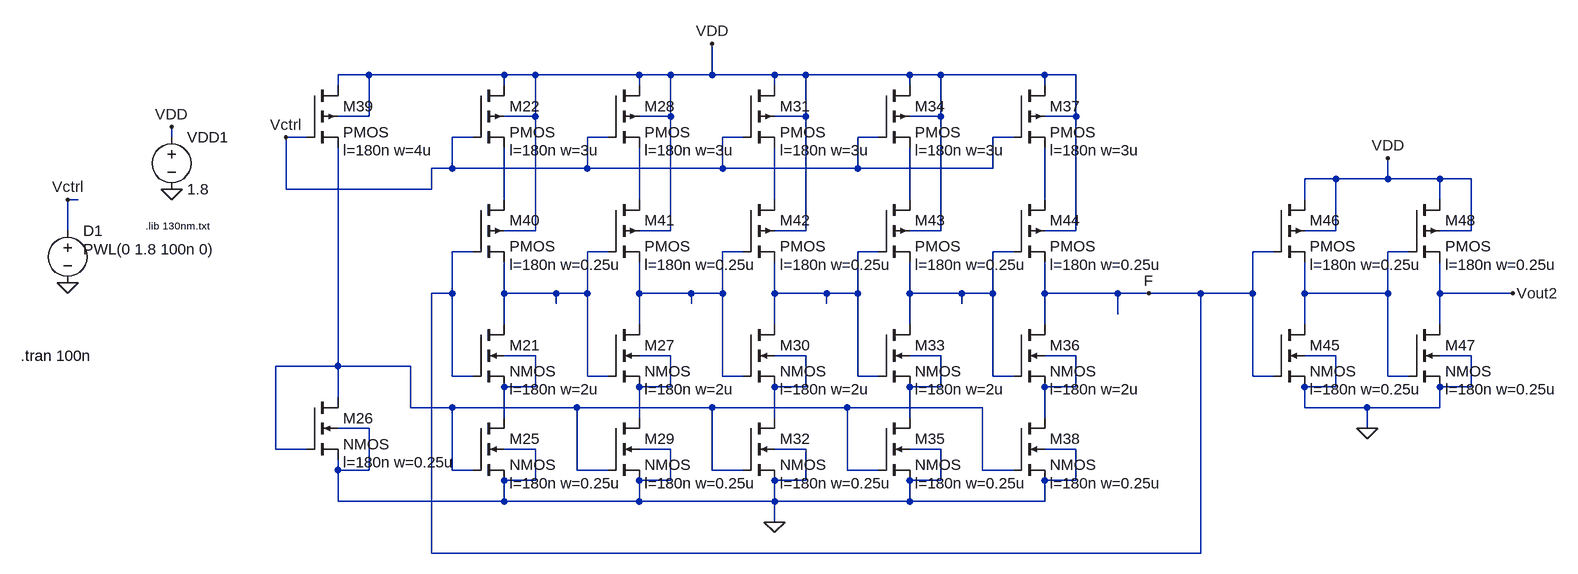
[diagram p0: schematic VCO.asc]
VCO.asc, the LTspice schematic file:
Version 4
SHEET 1 1592 1668
WIRE -544 144 -592 144
WIRE -336 144 -544 144
WIRE -288 144 -336 144
WIRE -128 144 -288 144
WIRE -80 144 -128 144
WIRE -16 144 -16 96
WIRE -16 144 -80 144
WIRE 80 144 -16 144
WIRE 128 144 80 144
WIRE 288 144 128 144
WIRE 336 144 288 144
WIRE 496 144 336 144
WIRE 544 144 496 144
WIRE -592 160 -592 144
WIRE -336 160 -336 144
WIRE -128 160 -128 144
WIRE 80 160 80 144
WIRE 288 160 288 144
WIRE 496 160 496 144
WIRE -544 208 -544 144
WIRE -544 208 -592 208
WIRE -288 208 -288 144
WIRE -288 208 -336 208
WIRE -80 208 -80 144
WIRE -80 208 -128 208
WIRE 128 208 128 144
WIRE 128 208 80 208
WIRE 336 208 336 144
WIRE 336 208 288 208
WIRE 544 208 544 144
WIRE 544 208 496 208
WIRE -848 240 -848 224
WIRE -640 240 -672 240
WIRE -384 240 -416 240
WIRE -176 240 -208 240
WIRE 32 240 0 240
WIRE 240 240 208 240
WIRE 448 240 416 240
WIRE -416 288 -416 240
WIRE -416 288 -448 288
WIRE -208 288 -208 240
WIRE -208 288 -416 288
WIRE 0 288 0 240
WIRE 0 288 -208 288
WIRE 208 288 208 240
WIRE 208 288 0 288
WIRE 416 288 416 240
WIRE 416 288 208 288
WIRE 944 304 896 304
WIRE 1024 304 1024 272
WIRE 1024 304 944 304
WIRE 1104 304 1024 304
WIRE 1152 304 1104 304
WIRE -672 320 -672 240
WIRE -448 320 -448 288
WIRE -448 320 -672 320
WIRE -992 336 -1008 336
WIRE -336 336 -336 256
WIRE -128 336 -128 256
WIRE 80 336 80 256
WIRE 288 336 288 256
WIRE 496 336 496 256
WIRE 896 336 896 304
WIRE 1104 336 1104 304
WIRE -1008 384 -1008 336
WIRE -288 384 -288 208
WIRE -288 384 -336 384
WIRE -80 384 -80 208
WIRE -80 384 -128 384
WIRE 128 384 128 208
WIRE 128 384 80 384
WIRE 336 384 336 208
WIRE 336 384 288 384
WIRE 544 384 544 208
WIRE 544 384 496 384
WIRE 944 384 944 304
WIRE 944 384 896 384
WIRE 1152 384 1152 304
WIRE 1152 384 1104 384
WIRE -384 416 -416 416
WIRE -176 416 -208 416
WIRE 32 416 0 416
WIRE 240 416 208 416
WIRE 448 416 416 416
WIRE 848 416 816 416
WIRE 1056 416 1024 416
WIRE -416 480 -416 416
WIRE -416 480 -448 480
WIRE -336 480 -336 432
WIRE -256 480 -336 480
WIRE -208 480 -208 416
WIRE -208 480 -256 480
WIRE -128 480 -128 432
WIRE -48 480 -128 480
WIRE 0 480 0 416
WIRE 0 480 -48 480
WIRE 80 480 80 432
WIRE 160 480 80 480
WIRE 208 480 208 416
WIRE 208 480 160 480
WIRE 288 480 288 432
WIRE 368 480 288 480
WIRE 416 480 416 416
WIRE 416 480 368 480
WIRE 496 480 496 432
WIRE 608 480 496 480
WIRE 656 480 608 480
WIRE 736 480 656 480
WIRE 816 480 816 416
WIRE 816 480 736 480
WIRE 896 480 896 432
WIRE 1024 480 1024 416
WIRE 1024 480 896 480
WIRE 1104 480 1104 432
WIRE 1216 480 1104 480
WIRE -256 496 -256 480
WIRE -48 496 -48 480
WIRE 160 496 160 480
WIRE 368 496 368 480
WIRE 608 512 608 480
WIRE -336 528 -336 480
WIRE -128 528 -128 480
WIRE 80 528 80 480
WIRE 288 528 288 480
WIRE 496 528 496 480
WIRE 896 528 896 480
WIRE 1104 528 1104 480
WIRE -288 576 -336 576
WIRE -80 576 -128 576
WIRE 128 576 80 576
WIRE 336 576 288 576
WIRE 544 576 496 576
WIRE 944 576 896 576
WIRE 1152 576 1104 576
WIRE -592 592 -592 256
WIRE -592 592 -688 592
WIRE -480 592 -592 592
WIRE -416 608 -416 480
WIRE -384 608 -416 608
WIRE -208 608 -208 480
WIRE -176 608 -208 608
WIRE 0 608 0 480
WIRE 32 608 0 608
WIRE 208 608 208 480
WIRE 240 608 208 608
WIRE 416 608 416 480
WIRE 448 608 416 608
WIRE 816 608 816 480
WIRE 848 608 816 608
WIRE 1024 608 1024 480
WIRE 1056 608 1024 608
WIRE -288 624 -288 576
WIRE -288 624 -336 624
WIRE -80 624 -80 576
WIRE -80 624 -128 624
WIRE 128 624 128 576
WIRE 128 624 80 624
WIRE 336 624 336 576
WIRE 336 624 288 624
WIRE 544 624 544 576
WIRE 544 624 496 624
WIRE 944 624 944 576
WIRE 944 624 896 624
WIRE 1152 624 1152 576
WIRE 1152 624 1104 624
WIRE -592 640 -592 592
WIRE -480 656 -480 592
WIRE -416 656 -480 656
WIRE -224 656 -416 656
WIRE -16 656 -224 656
WIRE 192 656 -16 656
WIRE 400 656 192 656
WIRE 896 656 896 624
WIRE 992 656 896 656
WIRE 1104 656 1104 624
WIRE 1104 656 992 656
WIRE -336 672 -336 624
WIRE -128 672 -128 624
WIRE 80 672 80 624
WIRE 288 672 288 624
WIRE 496 672 496 624
WIRE -544 688 -592 688
WIRE 992 688 992 656
WIRE -688 720 -688 592
WIRE -640 720 -688 720
WIRE -288 720 -336 720
WIRE -80 720 -128 720
WIRE 128 720 80 720
WIRE 336 720 288 720
WIRE 544 720 496 720
WIRE -592 752 -592 736
WIRE -544 752 -544 688
WIRE -544 752 -592 752
WIRE -416 752 -416 656
WIRE -384 752 -416 752
WIRE -224 752 -224 656
WIRE -176 752 -224 752
WIRE -16 752 -16 656
WIRE 32 752 -16 752
WIRE 192 752 192 656
WIRE 240 752 192 752
WIRE 400 752 400 656
WIRE 448 752 400 752
WIRE -288 768 -288 720
WIRE -288 768 -336 768
WIRE -80 768 -80 720
WIRE -80 768 -128 768
WIRE 128 768 128 720
WIRE 128 768 80 768
WIRE 336 768 336 720
WIRE 336 768 288 768
WIRE 544 768 544 720
WIRE 544 768 496 768
WIRE -592 800 -592 752
WIRE -336 800 -336 768
WIRE -336 800 -592 800
WIRE -128 800 -128 768
WIRE -128 800 -336 800
WIRE 80 800 80 768
WIRE 80 800 -128 800
WIRE 288 800 288 768
WIRE 288 800 80 800
WIRE 496 800 496 768
WIRE 496 800 288 800
WIRE 80 832 80 800
WIRE -448 880 -448 480
WIRE 736 880 736 480
WIRE 736 880 -448 880
FLAG -1008 464 0
FLAG -848 320 0
FLAG -848 224 VDD
FLAG -1008 336 Vctrl
FLAG -16 96 VDD
FLAG 80 832 0
FLAG 992 688 0
FLAG 1024 272 VDD
FLAG 1216 480 Vout2
FLAG 656 480 F
FLAG -672 240 Vctrl
SYMBOL voltage -1008 368 R0
WINDOW 123 0 0 Left 0
WINDOW 39 24 124 Left 2
WINDOW 3 24 44 Left 2
SYMATTR Value PWL(0 1.8 100n 0)
SYMATTR InstName D1
SYMBOL voltage -848 224 R0
WINDOW 123 0 0 Left 0
WINDOW 39 24 124 Left 2
SYMATTR InstName VDD1
SYMATTR Value 1.8
SYMBOL nmos4 -384 528 R0
WINDOW 123 56 100 Left 2
SYMATTR Value2 l=180n w=2u
SYMATTR InstName M21
SYMBOL pmos4 -384 160 R0
WINDOW 123 56 100 Left 2
SYMATTR Value2 l=180n w=3u
SYMATTR InstName M22
SYMBOL nmos4 -384 672 R0
WINDOW 123 56 100 Left 2
SYMATTR Value2 l=180n w=0.25u
SYMATTR InstName M25
SYMBOL nmos4 -640 640 R0
WINDOW 123 56 100 Left 2
SYMATTR Value2 l=180n w=0.25u
SYMATTR InstName M26
SYMBOL nmos4 -176 528 R0
WINDOW 123 56 100 Left 2
SYMATTR Value2 l=180n w=2u
SYMATTR InstName M27
SYMBOL pmos4 -176 160 R0
WINDOW 123 56 100 Left 2
SYMATTR Value2 l=180n w=3u
SYMATTR InstName M28
SYMBOL nmos4 -176 672 R0
WINDOW 123 56 100 Left 2
SYMATTR Value2 l=180n w=0.25u
SYMATTR InstName M29
SYMBOL nmos4 32 528 R0
WINDOW 123 56 100 Left 2
SYMATTR Value2 l=180n w=2u
SYMATTR InstName M30
SYMBOL pmos4 32 160 R0
WINDOW 123 56 100 Left 2
SYMATTR Value2 l=180n w=3u
SYMATTR InstName M31
SYMBOL nmos4 32 672 R0
WINDOW 123 56 100 Left 2
SYMATTR Value2 l=180n w=0.25u
SYMATTR InstName M32
SYMBOL nmos4 240 528 R0
WINDOW 123 56 100 Left 2
SYMATTR Value2 l=180n w=2u
SYMATTR InstName M33
SYMBOL pmos4 240 160 R0
WINDOW 123 56 100 Left 2
SYMATTR Value2 l=180n w=3u
SYMATTR InstName M34
SYMBOL nmos4 240 672 R0
WINDOW 123 56 100 Left 2
SYMATTR Value2 l=180n w=0.25u
SYMATTR InstName M35
SYMBOL nmos4 448 528 R0
WINDOW 123 56 100 Left 2
SYMATTR Value2 l=180n w=2u
SYMATTR InstName M36
SYMBOL pmos4 448 160 R0
WINDOW 123 56 100 Left 2
SYMATTR Value2 l=180n w=3u
SYMATTR InstName M37
SYMBOL nmos4 448 672 R0
WINDOW 123 56 100 Left 2
SYMATTR Value2 l=180n w=0.25u
SYMATTR InstName M38
SYMBOL pmos4 -640 160 R0
WINDOW 123 56 100 Left 2
SYMATTR Value2 l=180n w=4u
SYMATTR InstName M39
SYMBOL pmos4 -384 336 R0
WINDOW 123 56 100 Left 2
SYMATTR Value2 l=180n w=0.25u
SYMATTR InstName M40
SYMBOL pmos4 -176 336 R0
WINDOW 123 56 100 Left 2
SYMATTR Value2 l=180n w=0.25u
SYMATTR InstName M41
SYMBOL pmos4 32 336 R0
WINDOW 123 56 100 Left 2
SYMATTR Value2 l=180n w=0.25u
SYMATTR InstName M42
SYMBOL pmos4 240 336 R0
WINDOW 123 56 100 Left 2
SYMATTR Value2 l=180n w=0.25u
SYMATTR InstName M43
SYMBOL pmos4 448 336 R0
WINDOW 123 56 100 Left 2
SYMATTR Value2 l=180n w=0.25u
SYMATTR InstName M44
SYMBOL nmos4 848 528 R0
WINDOW 123 56 100 Left 2
SYMATTR Value2 l=180n w=0.25u
SYMATTR InstName M45
SYMBOL pmos4 848 336 R0
WINDOW 123 56 100 Left 2
SYMATTR Value2 l=180n w=0.25u
SYMATTR InstName M46
SYMBOL nmos4 1056 528 R0
WINDOW 123 56 100 Left 2
SYMATTR Value2 l=180n w=0.25u
SYMATTR InstName M47
SYMBOL pmos4 1056 336 R0
WINDOW 123 56 100 Left 2
SYMATTR Value2 l=180n w=0.25u
SYMATTR InstName M48
TEXT -1080 576 Left 2 !.tran 100n
TEXT -888 376 Left 1 !.lib 130nm.txt

The netlist it stands for:
* VCO.asc
V§D1 Vctrl 0 PWL(0 1.8 100n 0)
VDD1 VDD 0 1.8
M21 N006 F N011 N011 NMOS l=180n w=2u
M22 VDD Vctrl N001 VDD PMOS l=180n w=3u
M25 N011 N016 0 0 NMOS l=180n w=0.25u
M26 N016 N016 0 0 NMOS l=180n w=0.25u
M27 N007 N006 N012 N012 NMOS l=180n w=2u
M28 VDD Vctrl N002 VDD PMOS l=180n w=3u
M29 N012 N016 0 0 NMOS l=180n w=0.25u
M30 N008 N007 N013 N013 NMOS l=180n w=2u
M31 VDD Vctrl N003 VDD PMOS l=180n w=3u
M32 N013 N016 0 0 NMOS l=180n w=0.25u
M33 N009 N008 N014 N014 NMOS l=180n w=2u
M34 VDD Vctrl N004 VDD PMOS l=180n w=3u
M35 N014 N016 0 0 NMOS l=180n w=0.25u
M36 F N009 N015 N015 NMOS l=180n w=2u
M37 VDD Vctrl N005 VDD PMOS l=180n w=3u
M38 N015 N016 0 0 NMOS l=180n w=0.25u
M39 VDD Vctrl N016 VDD PMOS l=180n w=4u
M40 N001 F N006 VDD PMOS l=180n w=0.25u
M41 N002 N006 N007 VDD PMOS l=180n w=0.25u
M42 N003 N007 N008 VDD PMOS l=180n w=0.25u
M43 N004 N008 N009 VDD PMOS l=180n w=0.25u
M44 N005 N009 F VDD PMOS l=180n w=0.25u
M45 N010 F 0 0 NMOS l=180n w=0.25u
M46 VDD F N010 VDD PMOS l=180n w=0.25u
M47 Vout2 N010 0 0 NMOS l=180n w=0.25u
M48 VDD N010 Vout2 VDD PMOS l=180n w=0.25u
.model NMOS NMOS
.model PMOS PMOS
.lib standard.mos
.tran 100n
.lib 130nm.txt
.backanno
.end